# EasyEDA Pro project ProDoc_PCB1_2026-06-18.epro

# Board PCB1
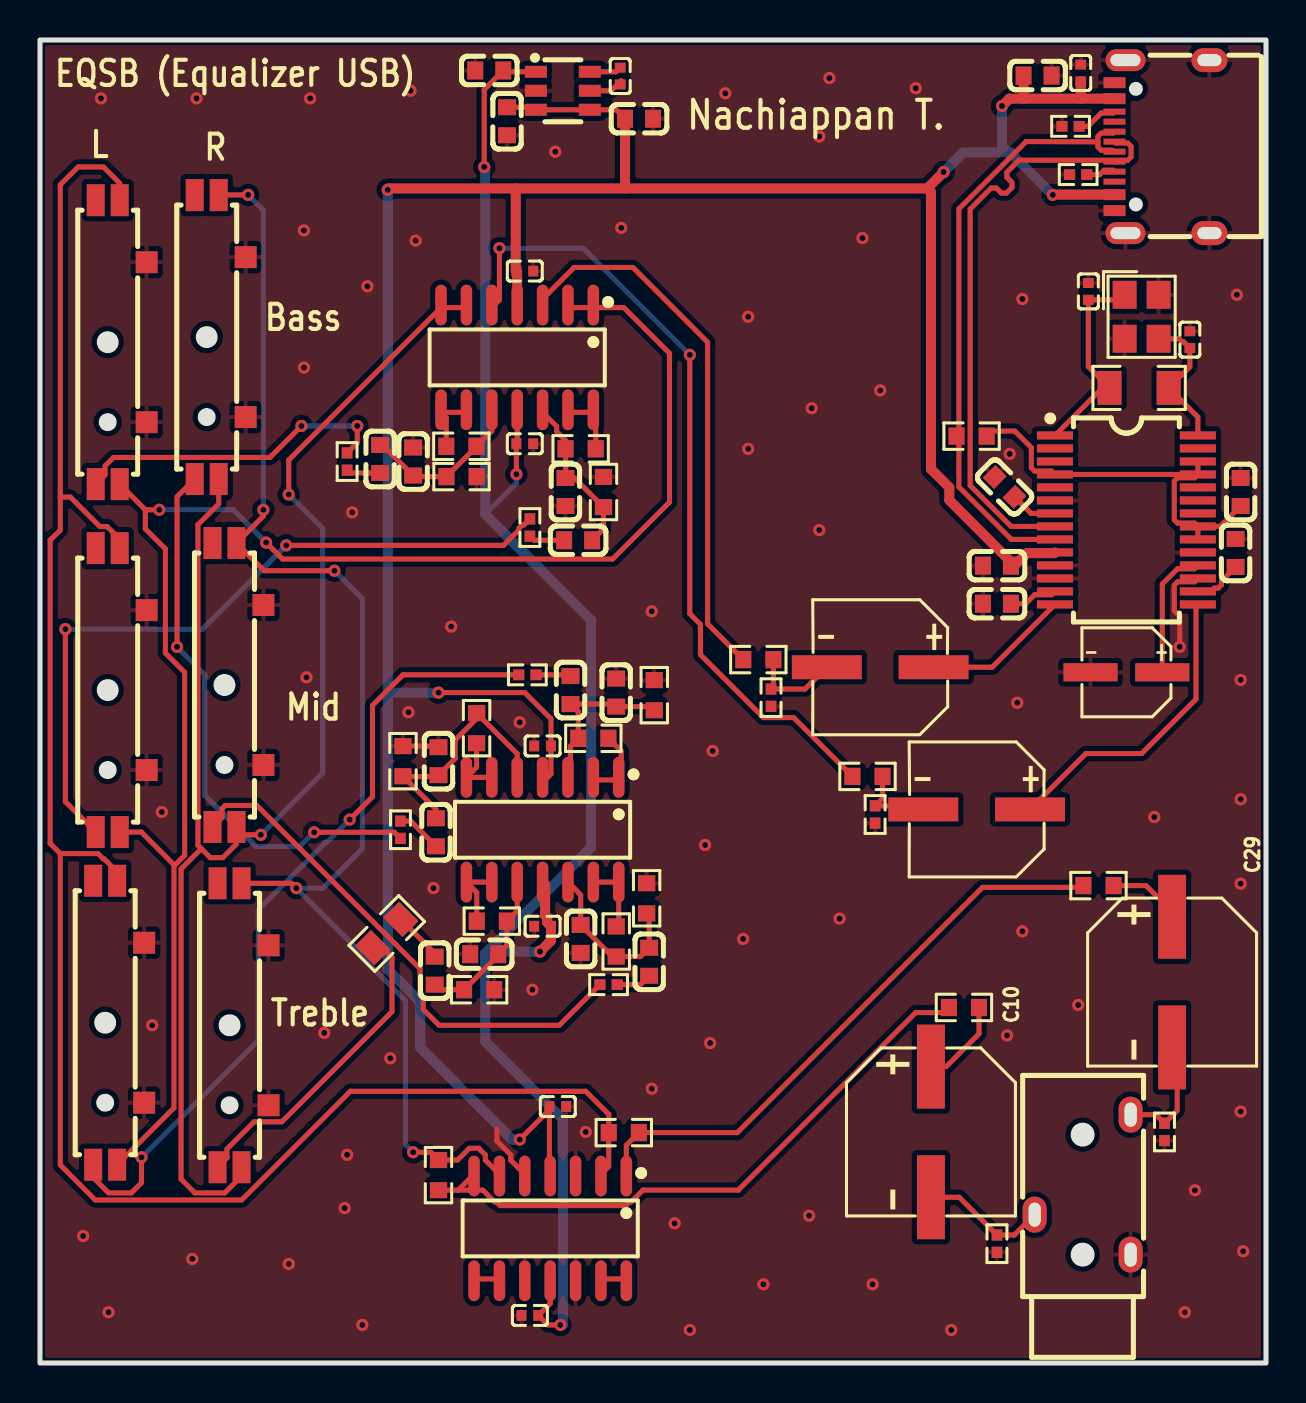
[diagram p0: board, top side]
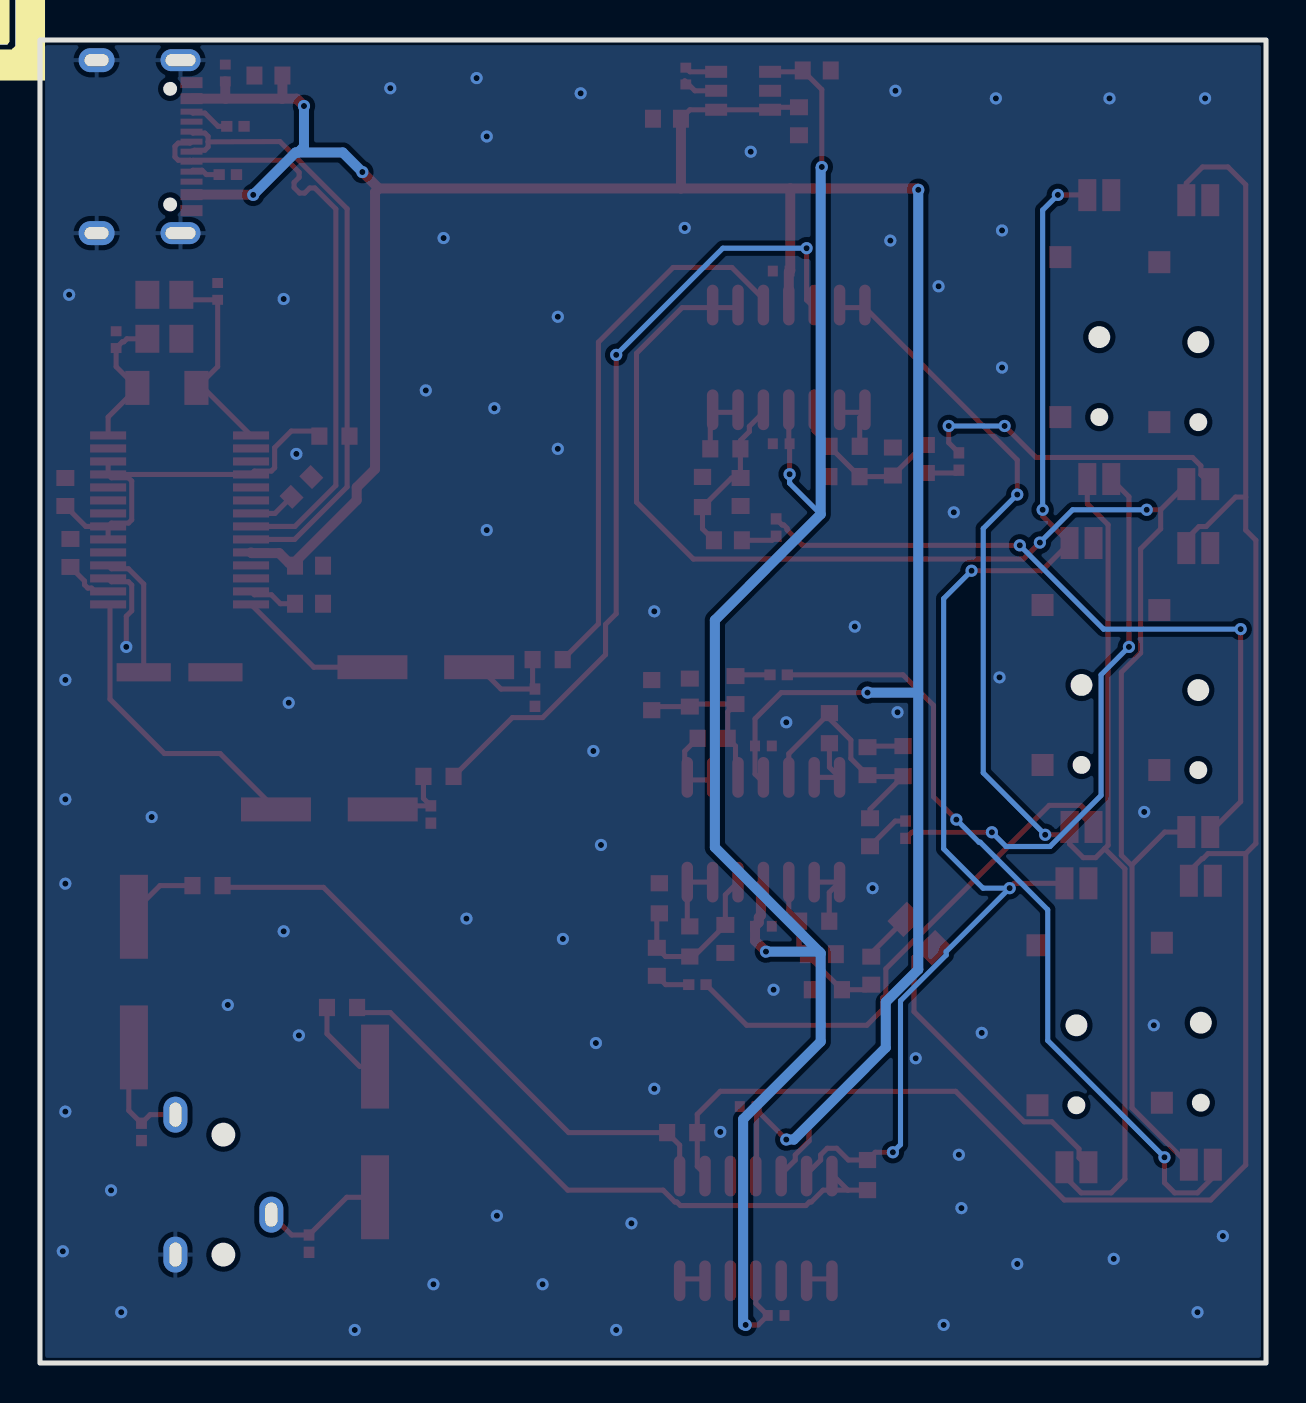
[diagram p1: board, bottom side, seen from below]

Outline 61.34 x 66.17 mm; copper layers: Top Layer, Bottom Layer. Coordinates in mm from the lower left corner of the outline.
Outline path: rectangle 0,66.17 61.34,0
Stack: Top Layer 0.035mm / Dielectric1 1.51mm FR4 er 4.5 / Bottom Layer 0.035mm

## Design rules (mm)
net DN: DP1
net DP: DP1
spacing copperThickness1oz (default): track to track 0.102, other pairs 0.152 to 0.3
spacing copperThickness2oz: track to track 0.203, other pairs 0.152 to 0.3
track width copperThickness1oz (default): min 0.127, default 0.254, max 2.54
track width copperThickness2oz: min 0.203, default 0.254, max 2.54
differential pair differentialPair (default): width min 0.127, default 0.254, max 2.54; gap min 0.152, default 0.152
net GND uses copperRegion

## Placement (name value [footprint] x y rotation side)
C1  100nF  [C0402]  52.07 64.52 270 top
C2  10uF  [C0603]  49.91 64.39 180 top
C3  22pF  [C0402]  57.53 51.18 270 top
C4  22pF  [C0402]  52.45 53.59 270 top
C5  1uF  [C0603]  48.26 43.81 315 top
C6  1uF  [C0603]  47.88 37.97 0 top
C7  1uF  [C0603]  60.07 43.56 270 top
C8  1uF  [C0603]  59.82 40.51 270 top
C9  1uF  [C0603]  47.88 39.88 0 top
C10  470uF  [CAP-SMD_BD8.0-L8.3-W8.3-FD]  44.58 11.56 270 top
C11  100uF  [CAP-SMD_BD6.3-L6.6-W6.6-FD]  42.04 34.8 180 top
C12  100uF  [CAP-SMD_BD6.3-L6.6-W6.6-FD]  46.86 27.69 180 top
C13  2.2uF  [C0603]  23.37 62.1 90 top
C14  1uF  [C0402]  29.03 64.36 270 top
C15  2.2uF  [C0603]  22.48 64.64 0 top
C16  470nF  [C0603]  17.02 45.21 90 top
C17  47nF  [C0603]  18.67 45.08 270 top
C18  22nF  [C0603]  26.92 41.15 180 top
C19  2.2nF  [C0603]  26.29 43.56 90 top
C20  220pF  [C0603]  28.83 33.53 270 top
C21  2.2nF  [C0603]  26.54 33.65 90 top
C22  470nF  [C0603]  19.81 26.54 90 top
C23  47nF  [C0603]  19.94 30.1 270 top
C24  22nF  [C0603]  30.48 20.07 270 top
C25  2.2nF  [C0603]  27.05 21.21 90 top
C26  220pF  [C0603]  22.23 20.45 0 top
C27  2.2nF  [C0603]  19.75 19.62 90 top
C28  10uF  [CAP-SMD_BD4.0-L4.3-W4.3-FD-LS5.1]  54.36 34.54 180 top
C29  470uF  [CAP-SMD_BD8.0-L8.3-W8.3-FD]  56.64 19.05 270 top
C30  100nF  [C0402]  24.26 54.61 180 top
C31  100nF  [C0402]  24.26 45.97 180 top
C32  100nF  [C0402]  25.91 12.83 180 top
C33  100nF  [C0402]  24.51 2.38 0 top
C34  100nF  [C0402]  25.15 30.86 0 top
C35  100nF  [C0402]  25.15 21.84 0 top
C36  10uF  [C0603]  29.97 62.23 180 top
CN1  PJ-3200  [AUDIO-TH_PJ-3200]  52.17 8.92 90 top
R1  5.1kΩ  [R0402]  51.94 59.44 0 top
R2  5.1kΩ  [R0402]  51.56 61.85 0 top
R3  100Ω  [R0603]  35.94 35.18 0 top
R4  100Ω  [R0603]  41.4 29.34 0 top
R5  1.5kΩ  [R0603]  46.61 46.35 180 top
R6  1MΩ  [R1206]  54.99 48.77 0 top
R7  10kΩ  [RES-ADJ-SMD_L13.2-W3.0_RS08U111Z001]  4.06 51.05 90 top
R8  1kΩ  [R0402]  15.37 45.08 90 top
R9  680Ω  [R0603]  21.08 45.85 180 top
R10  47kΩ  [R0603]  21.09 44.33 180 top
R11  10kΩ  [RES-ADJ-SMD_L13.2-W3.0_RS08U111Z001]  4.06 33.65 90 top
R12  1kΩ  [R0402]  24.51 41.78 90 top
R13  47kΩ  [R0603]  28.19 43.56 270 top
R14  680Ω  [R0603]  27.05 45.72 0 top
R15  10kΩ  [RES-ADJ-SMD_L13.2-W3.0_RS08U111Z001]  3.94 17.02 90 top
R16  1kΩ  [R0402]  24.38 34.42 180 top
R17  47kΩ  [R0603]  30.73 33.4 270 top
R18  680Ω  [R0603]  27.69 31.24 0 top
R19  10kΩ  [RES-ADJ-SMD_L13.2-W3.0_RS08U111Z001]  9.02 51.31 90 top
R20  1kΩ  [R0402]  18.03 26.67 270 top
R21  680Ω  [R0603]  21.84 31.75 270 top
R22  47kΩ  [R0603]  18.16 30.1 270 top
R23  10kΩ  [RES-ADJ-SMD_L13.2-W3.0_RS08U111Z001]  9.91 33.91 90 top
R24  1kΩ  [R0402]  28.45 18.92 180 top
R25  47kΩ  [R0603]  30.35 23.24 270 top
R26  680Ω  [R0603]  28.83 21.08 90 top
R27  10kΩ  [RES-ADJ-SMD_L13.2-W3.0_RS08U111Z001]  10.16 16.89 90 top
R28  1kΩ  [R0805]  17.35 21.48 45 top
R29  47kΩ  [R0603]  21.97 18.67 180 top
R30  680Ω  [R0603]  22.61 22.1 180 top
R31  10kΩ  [R0603]  29.21 11.52 0 top
R32  10kΩ  [R0603]  19.94 9.4 270 top
R33  10kΩ  [R0402]  36.58 33.27 90 top
R34  10kΩ  [R0402]  41.78 27.43 270 top
R35  4.7Ω  [R0603]  52.96 23.88 0 top
R36  51kΩ  [R0402]  47.88 5.97 90 top
R37  4.7Ω  [R0603]  46.23 17.78 180 top
R38  51kΩ  [R0402]  56.26 11.56 90 top
U1  PCM2704DB  [SSOP-28_L10.2-W5.3-P0.65-LS7.8-TL]  54.36 42.16 0 top
U2  LM2776DBVR  [SOT-23-6_L2.9-W1.6-P0.95-LS2.8-BR]  26.16 63.63 180 top
U6  OPA1654AIDR  [SOIC-14_L8.7-W3.9-P1.27-LS6.0-BL]  23.88 50.29 180 top
U7  OPA1654AIDR  [SOIC-14_L8.7-W3.9-P1.27-LS6.0-BL]  25.53 6.73 180 top
U8  OPA1654AIDR  [SOIC-14_L8.7-W3.9-P1.27-LS6.0-BL]  25.15 26.67 180 top
USB1  TYPE-C 16PIN 2MD(073)  [USB-C-SMD_TYPE-C-16PIN-2MD-073]  56.13 60.83 90 top
X1  12MHz  [CRYSTAL-SMD_4P-L3.2-W2.5-BL]  55.12 52.32 270 top

## Footprints (pads in the part's own frame, mm; a bottom-side part is the same pattern mirrored in y, then rotated)
AUDIO-TH_PJ-3200
  oval 1.8x1.2 hole 1.2x0.6: 2(-1.5,2.4) 3(-3.5,-2.4) 4(3.5,-2.4)
C0402
  rect 0.5x0.54 smd: 1(-0.42,0) 2(0.42,0)
C0603
  rect 0.8x0.9 smd: 1(-0.7,0) 2(0.7,0)
CAP-SMD_BD4.0-L4.3-W4.3-FD-LS5.1
  rect 2.71x0.91 smd: 1(-1.795,0) 2(1.795,0)
CAP-SMD_BD6.3-L6.6-W6.6-FD
  rect 3.5x1.2 smd: 1(-2.67,0) 2(2.67,0)
CAP-SMD_BD8.0-L8.3-W8.3-FD
  rect 4.2x1.4 smd: 1(-3.267,0) 2(3.267,0)
CRYSTAL-SMD_4P-L3.2-W2.5-BL
  rect 1.4x1.2 smd: 1(-1.1,-0.85) 2(1.1,-0.85) 3(1.1,0.85) 4(-1.1,0.85)
R0402
  rect 0.566x0.54 smd: 1(-0.433,0) 2(0.433,0)
R0603
  rect 0.806x0.864 smd: 1(-0.753,0) 2(0.753,0)
R0805
  rect 1.133x1.377 smd: 1(-1,0) 2(1,0)
R1206
  rect 1.208x1.701 smd: 1(-1.479,0) 2(1.479,0)
RES-ADJ-SMD_L13.2-W3.0_RS08U111Z001
  rect 1.6x0.9 smd: 1(-7.1,1.275) 2(-7.1,0.075) 3(7.1,0.075) 4(7.1,1.275)
  rect 1.1x1.1 smd: 5(-4,-1.275) 6(4,-1.275)
SOIC-14_L8.7-W3.9-P1.27-LS6.0-BL
  oval 0.574x2.038 smd: 1(-3.81,-2.619) 2(-2.54,-2.619) 3(-1.27,-2.619) 4(0,-2.619) 5(1.27,-2.619) 6(2.54,-2.619) 7(3.81,-2.619) 8(3.81,2.619) 9(2.54,2.619) 10(1.27,2.619) 11(0,2.619) 12(-1.27,2.619) 13(-2.54,2.619) 14(-3.81,2.619)
SOT-23-6_L2.9-W1.6-P0.95-LS2.8-BR
  rect 1.1x0.6 smd: 1(1.35,-0.95) 2(1.35,0) 3(1.35,0.95) 4(-1.35,0.95) 5(-1.35,0) 6(-1.35,-0.95)
SSOP-28_L10.2-W5.3-P0.65-LS7.8-TL
  rect 1.804x0.406 smd: 1(-3.575,4.225) 2(-3.575,3.575) 3(-3.575,2.925) 4(-3.575,2.275) 5(-3.575,1.625) 6(-3.575,0.975) 7(-3.575,0.325) 8(-3.575,-0.325) 9(-3.575,-0.975) 10(-3.575,-1.625) 11(-3.575,-2.275) 12(-3.575,-2.925) 13(-3.575,-3.575) 14(-3.575,-4.225) 15(3.575,-4.225) 16(3.575,-3.575) 17(3.575,-2.925) 18(3.575,-2.275) 19(3.575,-1.625) 20(3.575,-0.975) 21(3.575,-0.325) 22(3.575,0.325) 23(3.575,0.975) 24(3.575,1.625) 25(3.575,2.275) 26(3.575,2.925) 27(3.575,3.575) 28(3.575,4.225)
USB-C-SMD_TYPE-C-16PIN-2MD-073
  oval 1.1x2 hole 0.6x1.5: 13(-4.325,1.825) 14(4.325,1.825)
  oval 1.2x1.8 hole 0.6x1.2: 13(-4.325,-2.375) 14(4.325,-2.375)
  rect 0.55x1.1 smd: A1B12(-3.2,2.375) A4B9(-2.4,2.375) B1A12(3.2,2.375) B4A9(2.4,2.375)
  rect 0.3x1.1 smd: A5(-1.25,2.375) A6(-0.25,2.375) A7(0.25,2.375) A8(1.25,2.375) B5(1.75,2.375) B6(0.75,2.375) B7(-0.75,2.375) B8(-1.75,2.375)

## Nets
+5V: C1.2 C2.2 C9.2 C13.2 C30.2 C32.2 C34.2 C36.2 U1.10 U2.3 U2.4 U6.4 U7.4 U8.4 USB1.A4B9 USB1.B4A9
-5V: C15.2 C31.2 C33.2 C35.2 U2.1 U6.11 U7.11 U8.11
GND: C1.1 C2.1 C3.1 C4.1 C5.1 C6.1 C7.1 C8.1 C9.1 C13.1 C15.1 C17.1 C19.1 C20.1 C23.1 C25.1 C26.1 C28.2 C30.1 C31.1 C32.1 C33.1 C34.1 C35.1 C36.1 CN1.3 R1.1 R2.1 R7.5 R7.6 R10.1 R11.5 R11.6 R13.1 R15.5 R15.6 R17.1 R19.5 R19.6 R22.1 R23.5 R23.6 R25.1 R27.5 R27.6 R29.1 R33.1 R34.2 R36.1 R38.1 U1.6 U1.11 U1.12 U1.17 U1.19 U2.2 U7.3 U7.5 U7.10 U7.12 USB1.13 USB1.14 USB1.A1B12 USB1.B1A12 X1.2 X1.4
VCCP: C7.2 R5.1 U1.4 U1.20 U1.21 U1.25 U1.26
Audio_L: R3.1 U6.3
Audio_R: R4.1 U6.5
Buff_L: R7.2 R11.2 R15.2 U6.1 U6.2
Buff_R: R19.2 R23.2 R27.2 U6.6 U6.7
DN: U1.8 USB1.A7 USB1.B7
DP: R5.2 U1.9 USB1.A6 USB1.B6
Eq_Feedback_L: R7.3 R11.3 R15.3 R31.1 U7.2
Eq_Feedback_R: R19.3 R23.3 R27.3 R32.1 U7.6
OUT_L: R31.2 R35.1 U7.1
OUT_R: R32.2 R37.2 U7.7
XTI: C3.2 R6.2 U1.28 X1.3
XTO: C4.2 R6.1 U1.1 X1.1
$1N5: R1.2 USB1.A5
$1N7: R2.2 USB1.B5
$1N30: C6.2 U1.13
$1N31: C8.2 U1.16
$1N41: C28.1 U1.18
$1N56: C5.2 U1.7
$1N71: C14.2 U2.5
$1N72: C14.1 U2.6
$1N83: R7.1 R8.2
$1N85: C16.1 R8.1
$1N86: C16.2 C17.2 R9.1 R10.2 U6.10
$1N89: R9.2 U6.8 U6.9
$1N92: R14.2 U6.13 U6.14
$1N95: C18.1 C19.2 R13.2 R14.1 U6.12
$1N97: R11.1 R12.2
$1N101: C18.2 R12.1
$1N107: C20.2 C21.1 R17.2 R18.1 U8.3
$1N108: R15.1 R16.2
$1N111: C21.2 R16.1
$1N115: C24.2 R24.1
$1N119: R30.2 U8.8 U8.9
$1N120: R21.2 U8.6 U8.7
$1N121: R26.2 U8.13 U8.14
$1N127: C26.2 C27.1 R29.2 R30.1 U8.10
$1N128: C22.2 C23.2 R21.1 R22.2 U8.5
$1N129: C24.1 C25.2 R25.2 R26.1 U8.12
$1N130: C22.1 R20.1
$1N131: R19.1 R20.2
$1N132: R23.1 R24.2
$1N133: R27.1 R28.1
$1N141: R18.2 U8.1 U8.2
$1N156: U7.8 U7.9
$1N157: U7.13 U7.14
$1N202: C11.1 U1.14
$1N203: C11.2 R3.2 R33.2
$1N206: C12.1 U1.15
$1N207: C12.2 R4.2 R34.1
$1N214: C10.2 CN1.2 R36.2
$1N221: C29.2 CN1.4 R38.2
$1N259: C27.2 R28.2
$1N270: C10.1 R37.1
$1N271: C29.1 R35.2

Pads without a net: R7 4; R11 4; R15 4; R19 4; R23 4; R27 4; U1 2 3 5 22 23 24 27; USB1 A8 B8

## Via types
v1: diameter 0.61, hole 0.305, Top Layer to Bottom Layer, 97 vias

## Routing (per net, layer and track width the routed paths; a pad name or vN(x,y) marks a point on that pad's centre or on a via; arc(x,y) is an arc through that point)
+5V: length 154.4
  Top Layer w0.254: 25.49,12.66 25.49,9.48 25.53,9.44 ; 25.49,12.66 C32.2 ; 25.49,12.66 v1(24,11.18) ; C13.2 24.69,62.8 U2.3 U2.4 28.83,62.68 C36.2 ; 25.27,29.16 25.57,29.45 C34.2 25.57,32.22 24.26,33.53 v1(19.94,33.53)
  Top Layer w0.5: 49.22,63.23 52.05,63.23 ; 49.22,63.23 48.5,63.23 v1(48.13,62.86) ; 49.22,63.23 49.21,63.25 C2.2 ; 52.05,63.23 USB1.B4A9 ; 52.05,63.23 52.07,63.25 C1.2 ; 23.8,58.74 23.8,54.64 C30.2 ; 23.8,58.74 17.47,58.74 v1(17.4,58.67) ; 23.8,58.74 29.27,58.74 ; 44.39,58.74 29.27,58.74 ; 44.39,58.74 v1(45.21,59.56) ; 44.39,58.74 44.58,58.55 44.58,44.71 45.49,43.79 45.49,43.15 48.44,40.2 ; 29.27,58.74 C36.2 ; 23.88,54.57 23.88,52.78 ; U1.10 50.75,40.5 49.37,40.5 48.87,40 48.71,40 C9.2 ; USB1.A4B9 50.69,58.43 v1(50.67,58.42)
  Bottom Layer w0.5: 48.42,60.54 48.13,60.83 v1(48.13,62.86) ; 48.42,60.54 48.55,60.54 v1(50.67,58.42) ; 48.42,60.54 46.19,60.54 v1(45.21,59.56) ; v1(24,11.18) 23.62,11.18 19.02,15.77 19.02,18.05 17.4,19.68 17.4,33.48 ; 17.4,33.48 17.45,33.53 v1(19.94,33.53) ; 17.4,33.48 v1(17.4,58.67)
-5V: length 86.3
  Top Layer w0.254: 25.53,4.2 25.53,2.97 C33.2 25.41,1.91 v1(26.04,1.91) ; v1(22.23,59.82) 22.23,63.69 C15.2 23.24,64.58 U2.1 ; 23.88,47.55 23.88,46.01 C31.2 v1(23.84,44.45)
  Top Layer w0.5: v1(25.02,20.57) 25.57,21.12 C35.2 25.38,22.03 25.38,22.28 25.27,22.39 25.27,23.92
  Bottom Layer w0.254: v1(23.84,44.45) 23.84,44 22.28,42.45
  Bottom Layer w0.5: v1(22.23,59.82) 22.28,59.76 22.28,42.45 27.58,37.15 27.58,25.79 22.36,20.57 ; 22.36,20.57 22.28,20.5 22.28,16.07 26.16,12.19 26.16,1.91 ; 22.36,20.57 v1(25.02,20.57)
GND: length 9.1
  Top Layer w0.254: R22.1 19.89,30.85 C23.1 ; 22.86,11.68 22.86,11.1 23.55,10.41 23.55,10.15 24.26,9.44 ; U1.17 57.76,39.07 56.91,39.07 56.75,38.91 56.75,37.62 57.02,37.35 v1(57.02,35.81)
  vias: v1(2.16,6.35) v1(3.05,63.25) v1(3.43,2.54) v1(5.61,16.89) v1(6.1,27.56) v1(7.62,5.21) v1(7.83,63.25) v1(12.45,4.95) v1(13.21,56.64) v1(13.21,49.78) v1(13.34,34.29) v1(13.52,63.25) v1(14.22,16.51) v1(15.24,7.75) v1(15.37,10.41) v1(15.62,42.54) v1(16.13,1.91) v1(16.38,53.85) v1(17.53,15.24) v1(18.44,32.54) v1(18.54,63.63) v1(18.8,56.13) v1(19.68,23.75) v1(20.57,36.83) v1(24,32.04) v1(24.64,18.67) v1(25.78,60.58) v1(27.3,11.56) v1(29.08,56.77) v1(30.61,37.59) v1(30.61,13.72) v1(31.75,6.98) v1(32.51,1.65) v1(33.27,25.91) v1(33.53,16) v1(33.66,30.61) v1(34.29,63.5) v1(35.18,21.21) v1(35.43,52.32) v1(35.43,45.72) v1(36.2,3.94) v1(38.48,7.37) v1(38.61,47.75) v1(38.99,61.34) v1(38.99,41.66) v1(39.5,64.26) v1(40.01,22.22) v1(41.15,56.26) v1(41.66,3.94) v1(42.04,48.64) v1(43.82,63.75) v1(45.59,1.65) v1(48.39,16.38) v1(48.51,45.47) v1(48.89,33.02) v1(49.15,53.21) v1(49.15,21.59) v1(51.94,17.91) v1(55.75,27.3) v1(57.28,2.54) v1(57.79,8.64) v1(59.88,53.42) v1(60.07,34.16) v1(60.07,28.19) v1(60.07,23.97) v1(60.07,12.57) v1(60.2,5.59)
VCCP: length 20.6
  Top Layer w0.254: R5.1 47.62,46.61 48.77,46.61 49.6,45.78 49.6,44.77 49.76,44.61 50.61,44.61 U1.4 U1.25 ; U1.25 57.76,44.27 56.91,44.27 56.75,44.11 56.75,42.17 56.91,42.01 57.76,42.01 U1.21 ; U1.25 U1.26 ; C7.2 59.05,41.84 U1.21 ; U1.21 U1.20
AUDIO_L: length 27.5
  Top Layer w0.254: 25.15,52.78 25.15,53.21 26.72,54.79 29.67,54.79 33.4,51.05 33.4,36.97 35.19,35.18
Audio_R: length 40.2
  Top Layer w0.254: v1(32.51,50.42) 32.51,37.47 33.05,36.94 33.05,35.42 36.19,32.28 37.71,32.28 R4.1 ; 22.61,52.78 22.99,53.16 v1(22.99,55.75)
  Bottom Layer w0.254: v1(32.51,50.42) 27.18,55.75 v1(22.99,55.75)
BUFF_L: length 55.5
  Top Layer w0.254: 6.73,24.89 7.24,25.4 7.24,34.54 6.27,35.51 6.27,40.72 5.27,41.72 5.27,42.67 3.99,43.95 ; 28.65,40.21 12.14,40.21 ; 3.99,26.55 5.07,26.55 6.7,24.92 6.7,12.76 ; 26.42,52.78 29.21,52.78
Buff_L: length 26.6
  Top Layer w0.254: 28.65,40.21 31.5,43.05 31.5,50.5 29.21,52.78 ; 3.86,9.92 6.7,12.76 ; v1(5.97,42.67) 5.27,42.67 ; 12.14,40.21 v1(11.31,41.03)
  Bottom Layer w0.254: v1(11.31,41.03) 9.67,42.67 v1(5.97,42.67)
BUFF_R: length 66.3
  Top Layer w0.254: 8.52,25.27 8.07,25.72 ; 8.07,25.72 7.06,24.71 7.06,9.2 ; 8.07,25.72 7.9,25.89 7.9,41.92 ; 7.75,8.51 9.25,8.51 10.09,9.35 ; 12.45,45.16 20.07,52.78
  Bottom Layer w0.254: 12.45,43.43 14.15,41.73 14.15,29.51 11.05,26.42
Buff_R: length 11
  Top Layer w0.254: 7.9,41.92 8.94,42.96 8.94,44.21 ; 8.52,25.27 9.14,25.27 9.83,25.96 R23.2 10.22,26.42 v1(11.05,26.42) ; v1(12.45,43.43) 12.45,45.16 ; R27.2 10.09,9.35 ; 7.75,8.51 7.06,9.2 ; 20.07,52.78 21.34,52.78
DN: length 30.6
  Top Layer w0.254: U1.8 48.58,41.84 46.54,43.89 46.54,57.71 47.59,58.77 47.84,58.77 48.1,58.51 48.35,58.51 48.63,58.79 48.63,59.04 48.37,59.3 48.37,59.55 48.98,60.15 53.69,60.15 USB1.B7 53.83,60.15 54.42,60.15 54.59,60.32 54.59,60.85 54.42,61.01 53.83,61.01 USB1.A7
DP: length 30.5
  Top Layer w0.254: 52.93,61.07 52.93,61.35 53.09,61.51 53.69,61.51 USB1.B6 ; 52.93,61.07 49.34,61.09 45.97,57.72 45.97,43.81 48.6,41.19 U1.9 ; 52.93,61.07 52.93,60.82 53.09,60.65 53.61,60.65 53.66,60.61 53.74,60.61 USB1.A6
EQ_FEEDBACK_L: length 60.5
  Top Layer w0.254: 10.09,8.15 2.77,8.15 1.02,9.91 1.02,25.48 0.51,25.98 0.51,41.15 1.02,41.66 1.02,58.93 1.91,59.82
Eq_Feedback_L: length 35.5
  Top Layer w0.254: R7.3 3.99,59 3.17,59.82 1.91,59.82 ; 28.07,9.44 28.46,9.83 R31.1 28.46,12.44 27.3,13.59 15.53,13.59 10.09,8.15 ; 1.02,43.31 1.52,43.31 3,41.83 3.35,41.83 3.81,41.38 3.81,40.93 R11.3 ; 3.86,24.12 3.86,24.56 3.2,25.22 3.16,25.22 2.9,25.48 1.02,25.48
EQ_FEEDBACK_R: length 18.3
  Top Layer w0.254: 22.28,10.15 22.99,9.44
  Bottom Layer w0.254: 14.16,23.75 16.13,25.72 16.13,38.23 14.73,39.62
Eq_Feedback_R: length 49.5
  Top Layer w0.254: 8.94,58.41 8.95,58.42 v1(10.41,58.42) ; 22.28,10.15 22.28,10.41 21.95,10.74 21.48,10.74 20.89,10.15 R32.1 19.55,10.54 v1(18.67,10.54) ; R27.3 12.59,23.99 v1(12.83,23.75) ; v1(11.18,42.67) 11.18,42.35 R23.3 11.22,39.62 v1(14.73,39.62)
  Bottom Layer w0.254: v1(10.41,58.42) 11.18,57.66 v1(11.18,42.67) ; 14.16,23.75 v1(12.83,23.75) 16,20.57 16,20.4 18.29,18.11 18.29,10.92 v1(18.67,10.54)
OUT_L: length 29.7
  Top Layer w0.254: R35.1 52.12,23.79 47.16,23.79 34.89,11.52 R31.2 29.34,10.9 29.34,9.44
OUT_R: length 31
  Top Layer w0.254: 45.47,17.52 45.46,17.53 43.82,17.53 34.93,8.64 30.16,8.64 29.57,8.05 29.48,8.05 29.3,7.87 23.02,7.87 22.85,8.05 22.75,8.05 22.16,8.64 20.92,8.64 ; 21.72,9.44 20.92,8.64 ; 20.92,8.64 R32.2
XTI: length 7.2
  Top Layer w0.254: X1.3 56.99,51.22 57.15,51.07 57.22,51.07 C3.2 57.53,49.83 R6.2 57.93,47.31 U1.28
XTO: length 10.5
  Top Layer w0.254: 54.27,53.42 54.02,53.17 C4.2 52.45,49.83 R6.1 53.16,48.77 U1.1
$1N5: length 1.5
  Top Layer w0.254: R1.2 53.02,59.44 53.24,59.65 53.69,59.65 USB1.A5
$1N7: length 2.1
  Top Layer w0.254: USB1.B5 53.69,62.51 53.09,62.51 52.43,61.85 R2.2
$1N30: length 2.5
  Top Layer w0.254: C6.2 49.32,37.97 49.76,38.42 50.61,38.42 U1.13
$1N31: length 2.5
  Top Layer w0.254: C8.2 59.11,39.11 59.11,38.92 58.95,38.76 58.76,38.76 58.59,38.59 U1.16
$1N41: length 6.6
  Top Layer w0.254: U1.18 57.76,39.72 56.91,39.72 56.15,38.96 C28.1
$1N56: length 2.4
  Top Layer w0.254: U1.7 49.59,42.49 C5.2
$1N71: length 1.8
  Top Layer w0.254: U2.5 28.58,63.63 29.08,64.13
$1N72: length 1.6
  Top Layer w0.254: C14.1 28.82,64.58 U2.6
$1N83: length 16.1
  Top Layer w0.254: 15.37,45.52 15.88,46.03 v1(15.88,46.86) ; R7.1 3.26,44.42 3.26,44.87 3.68,45.29 11.5,45.29 v1(13.08,46.86)
  Bottom Layer w0.254: v1(13.08,46.86) v1(15.88,46.86)
$1N85: length 1.7
  Top Layer w0.254: C16.1 15.51,44.51 R8.1
$1N86: length 8.1
  Top Layer w0.254: 22.61,47.55 22.61,46.62 R9.1 21.84,45.83 R10.2 18.72,44.33 C17.2 17.14,45.91 C16.2
$1N89: length 3.1
  Top Layer w0.254: 21.34,47.55 20.07,47.55 20.33,47.28 R9.2
$1N92: length 3.1
  Top Layer w0.254: R14.2 27.8,47.43 27.69,47.55 26.42,47.55
$1N95: length 8.2
  Top Layer w0.254: C18.1 28.19,41.72 R13.2 26.74,44.26 C19.2 26.3,44.27 R14.1 26.3,46.13 25.85,46.58 25.85,46.84 25.15,47.55
$1N97: length 36.3
  Top Layer w0.254: R12.2 24.21,41.91 24.13,41.91 23.96,41.75 23.96,41.67 23.19,40.89 v1(12.32,40.89) ; v1(1.27,36.7) 1.27,28.07 R11.1
  Bottom Layer w0.254: v1(12.32,40.89) 8.13,36.7 v1(1.27,36.7)
$1N101: length 1.8
  Top Layer w0.254: C18.2 24.71,41.15 R12.1
$1N107: length 8.4
  Top Layer w0.254: R17.2 30.55,32.83 C20.2 28.7,32.95 C21.1 26.93,32.57 R18.1 26.54,30.85 26.54,29.16
$1N108: length 40.3
  Top Layer w0.254: v1(5.08,10.29) 5.08,9.02 4.57,8.51 3.43,8.51 2.54,9.4 2.54,9.8 2.66,9.92 ; R16.2 18.16,34.42 16.64,32.89 16.64,28.32 v1(15.49,27.18)
  Bottom Layer w0.254: v1(5.08,10.29) 10.92,16.13 10.92,22.67 14.3,26.05 14.36,26.05 v1(15.49,27.18)
$1N111: length 1.8
  Top Layer w0.254: R16.1 26.48,34.42 C21.2
$1N115: length 1.8
  Top Layer w0.254: R24.1 30.04,18.92 C24.2
$1N119: length 3.4
  Top Layer w0.254: R30.2 21.85,23.53 U8.8 U8.9
$1N120: length 3.2
  Top Layer w0.254: R21.2 21.84,29.8 U8.7 U8.6
$1N121: length 3.5
  Top Layer w0.254: R26.2 28.96,21.96 U8.14 U8.13
$1N127: length 8.1
  Top Layer w0.254: C27.1 20,18.67 R29.2 22.92,20.38 C26.2 23.36,20.88 R30.1 23.88,22.61 U8.10
$1N128: length 12.4
  Top Layer w0.254: R22.2 19.81,27.69 C22.2 ; 20.19,29.4 20.12,29.33 18.54,29.33 ; U8.5 23.88,30.47 R21.1 21.84,32.23 20.77,31.15 20.77,30.23 C23.2
$1N129: length 8.4
  Top Layer w0.254: R25.2 30.48,22.36 C24.1 30.04,20.33 R26.1 28.63,20.33 C25.2 27.05,23.42 U8.12
$1N130: length 2.3
  Top Layer w0.254: C22.1 18.55,27.1 R20.1
$1N131: length 28
  Top Layer w0.254: 7.74,44.21 6.86,43.32 v1(6.86,35.81) ; R20.2 17.73,26.54 17.65,26.54 17.65,26.54 v1(13.72,26.54)
  Bottom Layer w0.254: v1(6.86,35.81) 8.25,34.42 8.25,28.38 10.81,25.83 13,25.83 v1(13.72,26.54)
$1N132: length 26.6
  Top Layer w0.254: R23.1 9.1,27.28 9.1,27.72 9.27,27.89 10.85,27.89 19.02,19.71 19.02,18.41 19.18,18.25 19.18,17.68 19.97,16.89 25.98,16.89 R24.2
$1N133: length 16.1
  Top Layer w0.254: R28.1 17.12,20.77 17.61,20.29 17.61,17.57 12.1,12.06 10.71,12.06 9.36,10.71 9.36,10.26 R27.1
$1N141: length 3.6
  Top Layer w0.254: 27.81,29.16 29.08,29.16 29.08,30.6 R18.2
$1N156: length 1.3
  Top Layer w0.254: 22.99,4.2 21.72,4.2
$1N157: length 1.3
  Top Layer w0.254: 29.34,4.2 28.07,4.2
$1N202: length 7.4
  Top Layer w0.254: U1.14 47.64,34.8 C11.1
$1N203: length 4.8
  Top Layer w0.254: C11.2 38.28,33.71 R33.2 36.69,33.82 R3.2
$1N206: length 15.4
  Top Layer w0.254: U1.15 57.84,37.85 57.84,33.2 55.12,30.48 52.33,30.48 C12.1
$1N207: length 4.1
  Top Layer w0.254: R4.2 42.16,28.24 R34.1 44.01,27.86 C12.2
$1N214: length 6.4
  Top Layer w0.254: C10.2 45.99,8.29 R36.2 48.75,6.4 CN1.2
$1N221: length 5.1
  Top Layer w0.254: 56.9,14.98 56.9,12.62 R38.2 55.83,12.42 CN1.4
$1N259: length 2.6
  Top Layer w0.254: C27.2 19.75,20.49 R28.2
$1N270: length 3.6
  Top Layer w0.254: 45.34,14.82 46.98,16.47 R37.1
$1N271: length 3.8
  Top Layer w0.254: 56.9,22.32 55.34,23.88 R35.2

## Copper pours and planes (outline as drawn; the poured copper is in the pictures)
GND on Top Layer: -5.97,69.85 65.28,69.85 65.28,-1.27 -5.97,-1.27
GND on Bottom Layer: -9.65,67.82 65.02,67.82 65.02,-14.61 -9.65,-14.61

## Text on the board
Top Silkscreen Layer: EQSB (Equalizer USB) | L | R | Bass | Treble | Mid | Nachiappan T.
